# Altium schematic sheet [4] DAC.SchDoc
size A4
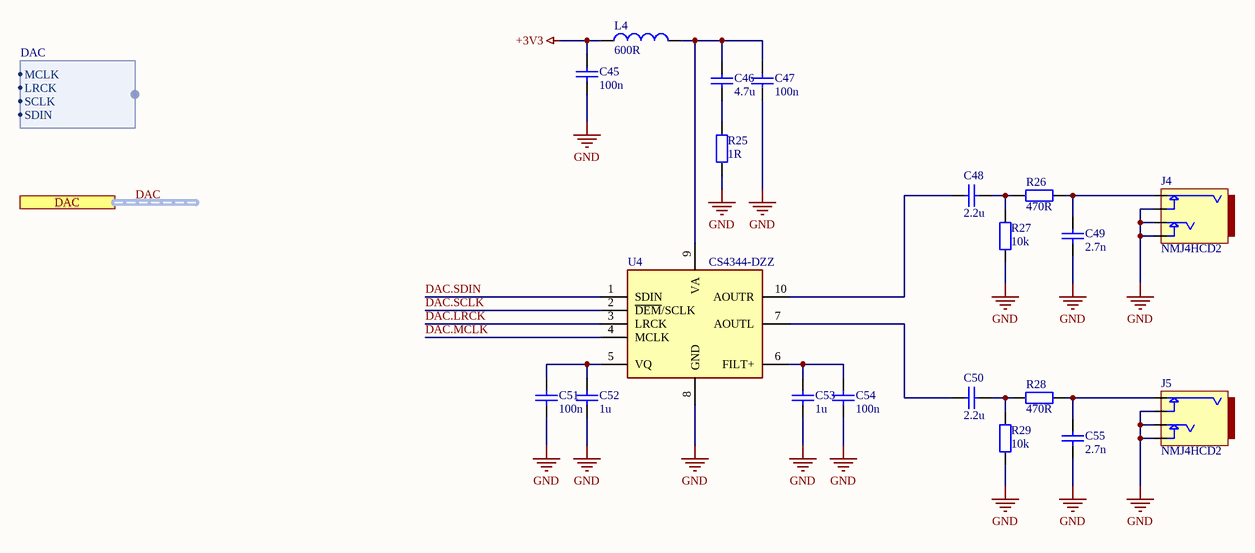
[diagram p0: [4] DAC.SchDoc]

## Parts
C45  100n  [Capacitor 0603]
C46  4.7u  [Capacitor 0603]
C47  100n  [Capacitor 0603]
C48  2.2u  [Capacitor 0603]
C49  2.7n  [Capacitor 0603]
C50  2.2u  [Capacitor 0603]
C51  100n  [Capacitor 0603]
C52  1u  [Capacitor 0603]
C53  1u  [Capacitor 0603]
C54  100n  [Capacitor 0603]
C55  2.7n  [Capacitor 0603]
J4  NMJ4HCD2  [Mechanical NMJ4HCD2]
J5  NMJ4HCD2  [Mechanical NMJ4HCD2]
L4  600R  [Inductor 0603]
R25  1R  [Resistor 0603]
R26  470R  [Resistor 0603]
R27  10k  [Resistor 0603]
R28  470R  [Resistor 0603]
R29  10k  [Resistor 0603]
U4  CS4344-DZZ  [TSSOP10]

## Ports
DAC (harness DAC)

## Harnesses
DAC: MCLK, LRCK, SCLK, SDIN

## Nets
+3V3: C45.2 L4.1
GND: C45.1 C47.1 C49.1 C51.1 C52.1 C53.1 C54.1 C55.1 J4.1(S) J4.2(SN) J4.4(TN) J5.1(S) J5.2(SN) J5.4(TN) R25.1 R27.1 R29.1 U4.8(GND)
DAC.LRCK: U4.3(LRCK)
DAC.MCLK: U4.4(MCLK)
DAC.SCLK: U4.2(~{DEM}/SCLK)
DAC.SDIN: U4.1(SDIN)
NetC46_1: C46.1 R25.2
NetC46_2: C46.2 C47.2 L4.2 U4.9(VA)
NetC48_1: C48.1 U4.10(AOUTR)
NetC48_2: C48.2 R26.1 R27.2
NetC49_2: C49.2 J4.3(T) R26.2
NetC50_1: C50.1 U4.7(AOUTL)
NetC50_2: C50.2 R28.1 R29.2
NetC51_2: C51.2 C52.2 U4.5(VQ)
NetC53_2: C53.2 C54.2 U4.6(FILT+)
NetC55_2: C55.2 J5.3(T) R28.2

## Buses and harness runs
harness DAC = port DAC

## Library data of the parts
C45 C47 C51 C54 = Capacitor 100n 10% 0603 EMK107B7104KA-T: Multilayer Ceramic Capacitors MLCC - SMD/SMT 0603 16VDC 0.1uF 10% X7R; Manufacturer: Taiyo Yuden; Type: SMD; Manufacturer Part Number: EMK107B7104KA-T; Footprint: 0603; Datasheet: https://pl.mouser.com/datasheet/2/396/mlcc02_e-1307760.pdf
C46 = Capacitor 4.7u 10% 0603 EMK107ABJ475KA-T: Multilayer Ceramic Capacitors MLCC - SMD/SMT 0603 16VDC 4.7uF 10% X5R; Manufacturer: Taiyo Yuden; Type: SMD; Manufacturer Part Number: EMK107ABJ475KA-T; Footprint: 0603; Datasheet: https://pl.mouser.com/datasheet/2/396/mlcc02_e-1307760.pdf
C48 C50 = Capacitor 2.2u 10% 0603 EMK107BJ225KA-T: Multilayer Ceramic Capacitors MLCC - SMD/SMT 0603 16VDC 2.2uF 10% X5R; Manufacturer: Taiyo Yuden; Type: SMD; Manufacturer Part Number: EMK107BJ225KA-T; Footprint: 0603; Datasheet: https://pl.mouser.com/datasheet/2/396/mlcc02_e-1307760.pdf
C49 C55 = Capacitor 2.7n 10% 0603 UMK107SD272KA-T: Multilayer Ceramic Capacitors MLCC - SMD/SMT 0603 50VDC 2.7nF 10% Low Distort; Manufacturer: Taiyo Yuden; Type: SMD; Manufacturer Part Number: UMK107SD272KA-T; Footprint: 0603; Datasheet: https://pl.mouser.com/datasheet/2/396/mlcc02_e-1307760.pdf
C52 C53 = Capacitor 1u 10% 0603 EMK107B7105KA-T: Multilayer Ceramic Capacitors MLCC - SMD/SMT 0603 16VDC 1uF 10% X7R; Manufacturer: Taiyo Yuden; Type: SMD; Manufacturer Part Number: EMK107B7105KA-T; Footprint: 0603; Datasheet: https://pl.mouser.com/datasheet/2/396/mlcc02_e-1307760.pdf
J4 J5 = Mechanical JACK Phone Connectors 2C MONO 2-SPST NC: Phone Connectors 2C MONO 2-SPST NC; Manufacturer: Neutrik; Manufacturer Part Number: NMJ4HCD2; Footprint: Solder Pin; Type: THT; Datasheet: https://pl.mouser.com/datasheet/2/289/nmj4hcd2-1853956.pdf
L4 = Inductor 600R 1% 0603 HZ0603C601R-10: Ferrite Beads 600ohms 100MHz 300mA Monolithic 0603 SMD; Manufacturer: Laird Performance Materials; Manufacturer Part Number: HZ0603C601R-10; Footprint: 0603; Type: SMD; Datasheet: https://www.mouser.com/catalog/specsheets/Laird_10092020_Laird%20MCP%20Catalog-EMI%20Filtering%20and%20RF%20Inductor%20Sep%202020.pdf
R25 = Resistor 1R 1% 0603 RT0603FRE071RL: Thin Film Resistors - SMD 1/10W 1 ohm ohm 50 ppm; Manufacturer: Yageo; Manufacturer Part Number: RT0603FRE071RL; Footprint: 0603; Type: SMD; Datasheet: https://pl.mouser.com/datasheet/2/447/PYu_RT_1_to_0_01_RoHS_L_11-1669912.pdf
R26 R28 = Resistor 470R 1% 0603 RT0603FRE07470RL: Thin Film Resistors - SMD 1/10W 470 ohm 1% 50ppm; Manufacturer: Yageo; Manufacturer Part Number: RT0603FRE07470RL; Footprint: 0603; Type: SMD; Datasheet: https://pl.mouser.com/datasheet/2/447/PYu_RT_1_to_0_01_RoHS_L_11-1669912.pdf
R27 R29 = Resistor 10k 1% 0603 RT0603FRE0710KL: Thin Film Resistors - SMD 10K ohm 1% 1/10W; Manufacturer: Yageo; Manufacturer Part Number: RT0603FRE0710KL; Footprint: 0603; Type: SMD; Datasheet: https://pl.mouser.com/datasheet/2/447/PYu_RT_1_to_0_01_RoHS_L_11-1669912.pdf
U4 = IC Audio D/A Converter ICs Stereo DAC 24-Bit 192kHz CS4344-DZZ: Audio D/A Converter ICs Stereo DAC 24-Bit 192kHz; Manufacturer: Cirrus Logic; Manufacturer Part Number: Audio D/A Converter ICs Stereo DAC 24-Bit 192kHz; Footprint: TSSOP-10; Type: SMD; Datasheet: https://pl.mouser.com/datasheet/2/76/CS4344_45_48_F2-1141644.pdf